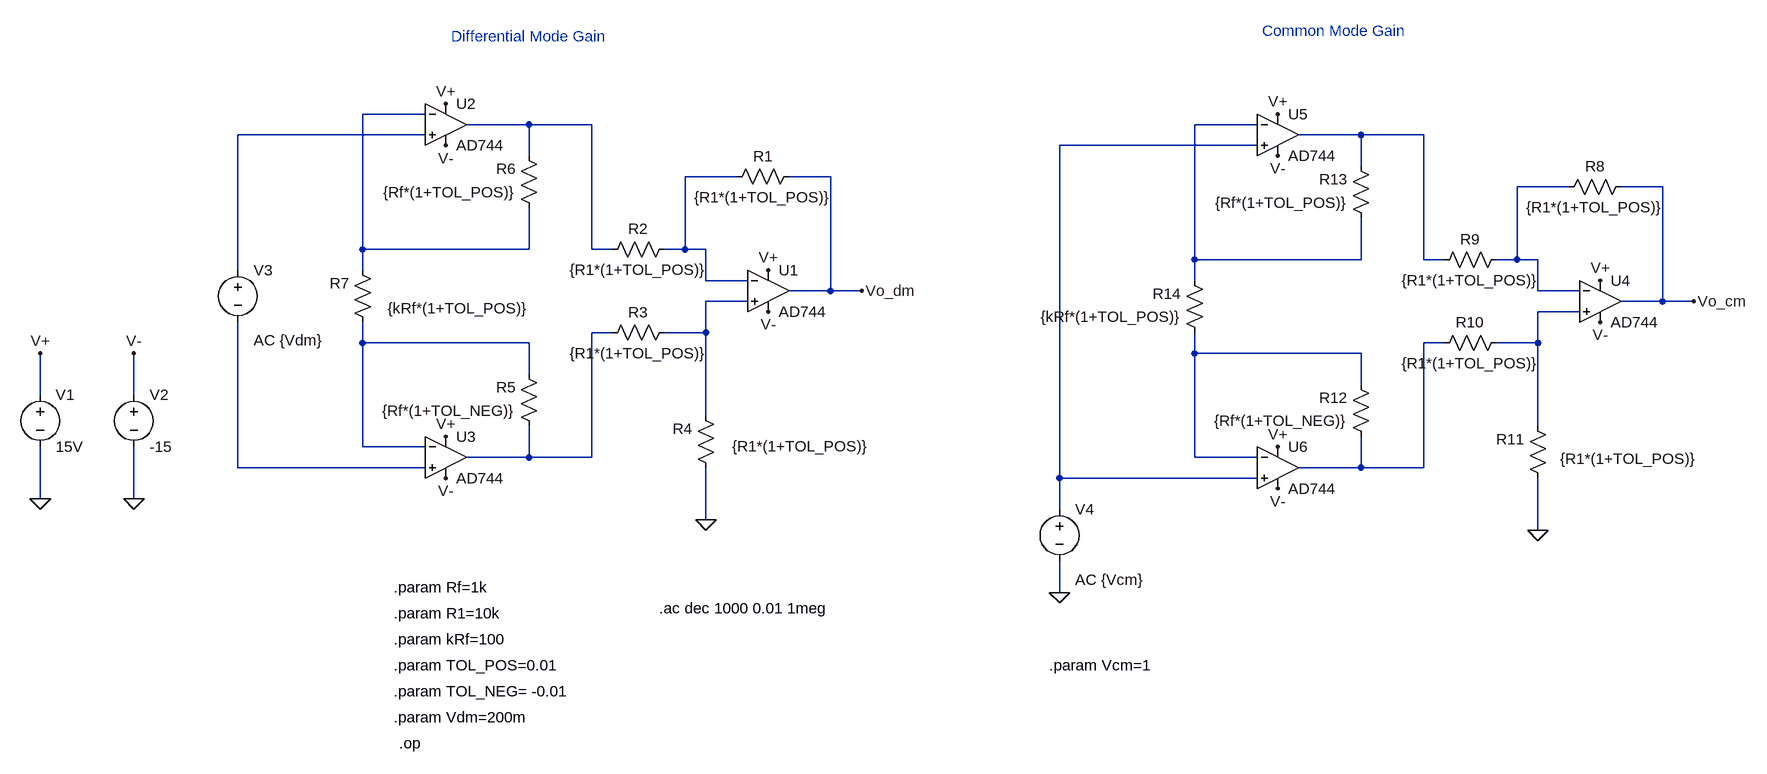
[diagram p0: schematic hw3_p5c_eantunano.asc]
hw3_p5c_eantunano.asc, the LTspice schematic file:
Version 4
SHEET 1 1780 984
WIRE -272 0 -368 0
WIRE -112 16 -208 16
WIRE -16 16 -112 16
WIRE 1008 16 912 16
WIRE -272 32 -560 32
WIRE 1168 32 1072 32
WIRE 1264 32 1168 32
WIRE 1008 48 704 48
WIRE -112 64 -112 16
WIRE 1168 80 1168 32
WIRE 208 96 128 96
WIRE 352 96 288 96
WIRE 1488 112 1408 112
WIRE 1632 112 1568 112
WIRE -368 208 -368 0
WIRE -112 208 -112 144
WIRE -112 208 -368 208
WIRE -16 208 -16 16
WIRE 16 208 -16 208
WIRE 128 208 128 96
WIRE 128 208 96 208
WIRE 160 208 128 208
WIRE 912 224 912 16
WIRE 1168 224 1168 160
WIRE 1168 224 912 224
WIRE 1264 224 1264 32
WIRE 1296 224 1264 224
WIRE 1408 224 1408 112
WIRE 1408 224 1376 224
WIRE 1440 224 1408 224
WIRE -560 240 -560 32
WIRE -368 240 -368 208
WIRE 160 256 160 208
WIRE 224 256 160 256
WIRE 912 256 912 224
WIRE 352 272 352 96
WIRE 352 272 288 272
WIRE 400 272 352 272
WIRE 1440 272 1440 224
WIRE 1504 272 1440 272
WIRE 224 288 160 288
WIRE 1632 288 1632 112
WIRE 1632 288 1568 288
WIRE 1680 288 1632 288
WIRE 1504 304 1440 304
WIRE 16 336 -16 336
WIRE 160 336 160 288
WIRE 160 336 96 336
WIRE -368 352 -368 320
WIRE -112 352 -368 352
WIRE 1296 352 1264 352
WIRE 1440 352 1440 304
WIRE 1440 352 1376 352
WIRE 912 368 912 336
WIRE 1168 368 912 368
WIRE -112 400 -112 352
WIRE 1168 416 1168 368
WIRE -864 432 -864 368
WIRE -720 432 -720 368
WIRE 160 464 160 336
WIRE 1440 480 1440 352
WIRE -368 512 -368 352
WIRE -272 512 -368 512
WIRE -112 528 -112 480
WIRE -112 528 -208 528
WIRE -16 528 -16 336
WIRE -16 528 -112 528
WIRE 912 528 912 368
WIRE 1008 528 912 528
WIRE -560 544 -560 320
WIRE -272 544 -560 544
WIRE 1168 544 1168 496
WIRE 1168 544 1072 544
WIRE 1264 544 1264 352
WIRE 1264 544 1168 544
WIRE 704 560 704 48
WIRE 1008 560 704 560
WIRE -864 592 -864 512
WIRE -720 592 -720 512
WIRE 704 608 704 560
WIRE 160 624 160 544
WIRE 1440 640 1440 560
WIRE 704 736 704 688
FLAG -720 592 0
FLAG -864 592 0
FLAG -720 368 V-
FLAG -864 368 V+
FLAG -240 496 V+
FLAG -240 -16 V+
FLAG 256 240 V+
FLAG -240 48 V-
FLAG -240 560 V-
FLAG 256 304 V-
FLAG 400 272 Vo_dm
FLAG 160 624 0
FLAG 1040 512 V+
FLAG 1040 0 V+
FLAG 1536 256 V+
FLAG 1040 64 V-
FLAG 1040 576 V-
FLAG 1536 320 V-
FLAG 1680 288 Vo_cm
FLAG 1440 640 0
FLAG 704 736 0
SYMBOL res 304 80 R90
WINDOW 0 0 56 VBottom 2
WINDOW 3 32 56 VTop 2
SYMATTR InstName R1
SYMATTR Value {R1*(1+TOL_POS)}
SYMBOL res 112 192 R90
WINDOW 0 0 56 VBottom 2
WINDOW 3 32 56 VTop 2
SYMATTR InstName R2
SYMATTR Value {R1*(1+TOL_POS)}
SYMBOL res 112 320 R90
WINDOW 0 0 56 VBottom 2
WINDOW 3 32 56 VTop 2
SYMATTR InstName R3
SYMATTR Value {R1*(1+TOL_POS)}
SYMBOL res 176 560 R180
WINDOW 0 36 76 Left 2
WINDOW 3 -236 49 Left 2
SYMATTR InstName R4
SYMATTR Value {R1*(1+TOL_POS)}
SYMBOL res -96 496 R180
WINDOW 0 36 76 Left 2
WINDOW 3 36 40 Left 2
SYMATTR InstName R5
SYMATTR Value {Rf*(1+TOL_NEG)}
SYMBOL res -96 160 R180
WINDOW 0 36 76 Left 2
WINDOW 3 36 40 Left 2
SYMATTR InstName R6
SYMATTR Value {Rf*(1+TOL_POS)}
SYMBOL res -352 336 R180
WINDOW 0 36 76 Left 2
WINDOW 3 -239 37 Left 2
SYMATTR InstName R7
SYMATTR Value {kRf*(1+TOL_POS)}
SYMBOL OpAmps\\AD744 256 208 R0
SYMATTR InstName U1
SYMBOL OpAmps\\AD744 -240 -48 R0
SYMATTR InstName U2
SYMBOL OpAmps\\AD744 -240 464 R0
SYMATTR InstName U3
SYMBOL voltage -864 416 R0
WINDOW 123 0 0 Left 0
WINDOW 39 0 0 Left 0
SYMATTR InstName V1
SYMATTR Value 15V
SYMBOL voltage -720 416 R0
WINDOW 123 0 0 Left 0
WINDOW 39 0 0 Left 0
SYMATTR InstName V2
SYMATTR Value -15
SYMBOL res 1584 96 R90
WINDOW 0 0 56 VBottom 2
WINDOW 3 32 56 VTop 2
SYMATTR InstName R8
SYMATTR Value {R1*(1+TOL_POS)}
SYMBOL res 1392 208 R90
WINDOW 0 0 56 VBottom 2
WINDOW 3 32 56 VTop 2
SYMATTR InstName R9
SYMATTR Value {R1*(1+TOL_POS)}
SYMBOL res 1392 336 R90
WINDOW 0 0 56 VBottom 2
WINDOW 3 32 56 VTop 2
SYMATTR InstName R10
SYMATTR Value {R1*(1+TOL_POS)}
SYMBOL res 1456 576 R180
WINDOW 0 36 76 Left 2
WINDOW 3 -230 46 Left 2
SYMATTR InstName R11
SYMATTR Value {R1*(1+TOL_POS)}
SYMBOL res 1184 512 R180
WINDOW 0 36 76 Left 2
WINDOW 3 36 40 Left 2
SYMATTR InstName R12
SYMATTR Value {Rf*(1+TOL_NEG)}
SYMBOL res 1184 176 R180
WINDOW 0 36 76 Left 2
WINDOW 3 36 40 Left 2
SYMATTR InstName R13
SYMATTR Value {Rf*(1+TOL_POS)}
SYMBOL res 928 352 R180
WINDOW 0 36 76 Left 2
WINDOW 3 36 40 Left 2
SYMATTR InstName R14
SYMATTR Value {kRf*(1+TOL_POS)}
SYMBOL OpAmps\\AD744 1536 224 R0
SYMATTR InstName U4
SYMBOL OpAmps\\AD744 1040 -32 R0
SYMATTR InstName U5
SYMBOL OpAmps\\AD744 1040 480 R0
SYMATTR InstName U6
SYMBOL voltage -560 224 R0
WINDOW 123 24 124 Left 2
WINDOW 39 0 0 Left 0
SYMATTR Value2 AC {Vdm}
SYMATTR InstName V3
SYMATTR Value ""
SYMBOL voltage 704 592 R0
WINDOW 123 24 124 Left 2
WINDOW 39 0 0 Left 0
SYMATTR Value2 AC {Vcm}
SYMATTR InstName V4
SYMATTR Value ""
TEXT -320 728 Left 2 !.param Rf=1k
TEXT -320 768 Left 2 !.param R1=10k
TEXT -320 808 Left 2 !.param kRf=100
TEXT -232 -120 Left 2 ;Differential Mode Gain
TEXT 1016 -128 Left 2 ;Common Mode Gain
TEXT 688 848 Left 2 !.param Vcm=1
TEXT -320 928 Left 2 !.param Vdm=200m
TEXT 88 760 Left 2 !.ac dec 1000 0.01 1meg
TEXT -320 848 Left 2 !.param TOL_POS=0.01
TEXT -320 888 Left 2 !.param TOL_NEG= -0.01
TEXT -312 968 Left 2 !.op

The netlist it stands for:
* hw3_p5c_eantunano.asc
R1 Vo_dm N007 {R1*(1+TOL_POS)}
R2 N007 N002 {R1*(1+TOL_POS)}
R3 N009 N011 {R1*(1+TOL_POS)}
R4 0 N009 {R1*(1+TOL_POS)}
R5 N011 N012 {Rf*(1+TOL_NEG)}
R6 N001 N002 {Rf*(1+TOL_POS)}
R7 N012 N001 {kRf*(1+TOL_POS)}
XU1 N009 N007 V+ V- Vo_dm AD744  ; pins In+ In- V+ V- OUT
XU2 N004 N001 V+ V- N002 AD744  ; pins In+ In- V+ V- OUT
XU3 N015 N012 V+ V- N011 AD744  ; pins In+ In- V+ V- OUT
V1 V+ 0 15V
V2 V- 0 -15
R8 Vo_cm N008 {R1*(1+TOL_POS)}
R9 N008 N005 {R1*(1+TOL_POS)}
R10 N010 N013 {R1*(1+TOL_POS)}
R11 0 N010 {R1*(1+TOL_POS)}
R12 N013 N014 {Rf*(1+TOL_NEG)}
R13 N003 N005 {Rf*(1+TOL_POS)}
R14 N014 N003 {kRf*(1+TOL_POS)}
XU4 N010 N008 V+ V- Vo_cm AD744  ; pins In+ In- V+ V- OUT
XU5 N006 N003 V+ V- N005 AD744  ; pins In+ In- V+ V- OUT
XU6 N006 N014 V+ V- N013 AD744  ; pins In+ In- V+ V- OUT
V3 N004 N015 AC {Vdm}
V4 N006 0 AC {Vcm}
.param Rf=1k
.param R1=10k
.param kRf=100
* Differential Mode Gain
* Common Mode Gain
.param Vcm=1
.param Vdm=200m
.ac dec 1000 0.01 1meg
.param TOL_POS=0.01
.param TOL_NEG= -0.01
.op
.backanno
.end